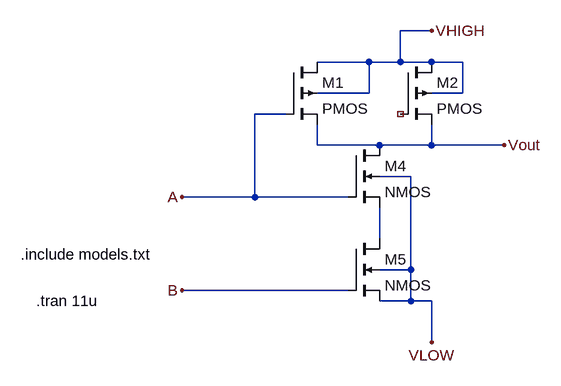
[diagram p0: schematic 2NAND.asc]
2NAND.asc, the LTspice schematic file:
Version 4
SHEET 1 960 708
WIRE 256 -32 208 -32
WIRE 160 16 80 16
WIRE 208 16 208 -32
WIRE 208 16 160 16
WIRE 256 16 208 16
WIRE 304 16 256 16
WIRE 160 64 160 16
WIRE 160 64 80 64
WIRE 304 64 304 16
WIRE 304 64 256 64
WIRE 32 96 -16 96
WIRE 80 144 80 112
WIRE 176 144 80 144
WIRE 256 144 256 112
WIRE 256 144 176 144
WIRE 368 144 256 144
WIRE 224 192 176 192
WIRE -16 224 -16 96
WIRE -16 224 -128 224
WIRE 128 224 -16 224
WIRE 176 288 176 240
WIRE 224 336 224 192
WIRE 224 336 176 336
WIRE 128 368 -128 368
WIRE 224 384 224 336
WIRE 224 384 176 384
WIRE 256 384 224 384
WIRE 256 448 256 384
FLAG -128 224 A
FLAG -128 368 B
FLAG 256 -32 VHIGH
FLAG 256 448 VLOW
FLAG 368 144 Vout
SYMBOL pmos4 32 16 R0
SYMATTR InstName M1
SYMATTR Value2 l=50n w=1u
SYMBOL pmos4 208 16 R0
SYMATTR InstName M2
SYMATTR Value2 l=50n w=1u
SYMBOL nmos4 128 144 R0
SYMATTR InstName M4
SYMATTR Value2 l=50n w=0.5u
SYMBOL nmos4 128 288 R0
SYMATTR InstName M5
SYMATTR Value2 l=50n w=0.5u
TEXT -376 312 Left 2 !.include models.txt
TEXT -352 384 Left 2 !.tran 11u

The netlist it stands for:
* 2NAND.asc
M1 VHIGH A Vout VHIGH PMOS l=50n w=1u
M2 VHIGH NC_01 Vout VHIGH PMOS l=50n w=1u
M4 Vout A N001 VLOW NMOS l=50n w=0.5u
M5 N001 B VLOW VLOW NMOS l=50n w=0.5u
.model NMOS NMOS
.model PMOS PMOS
.lib standard.mos
.include models.txt
.tran 11u
.backanno
.end